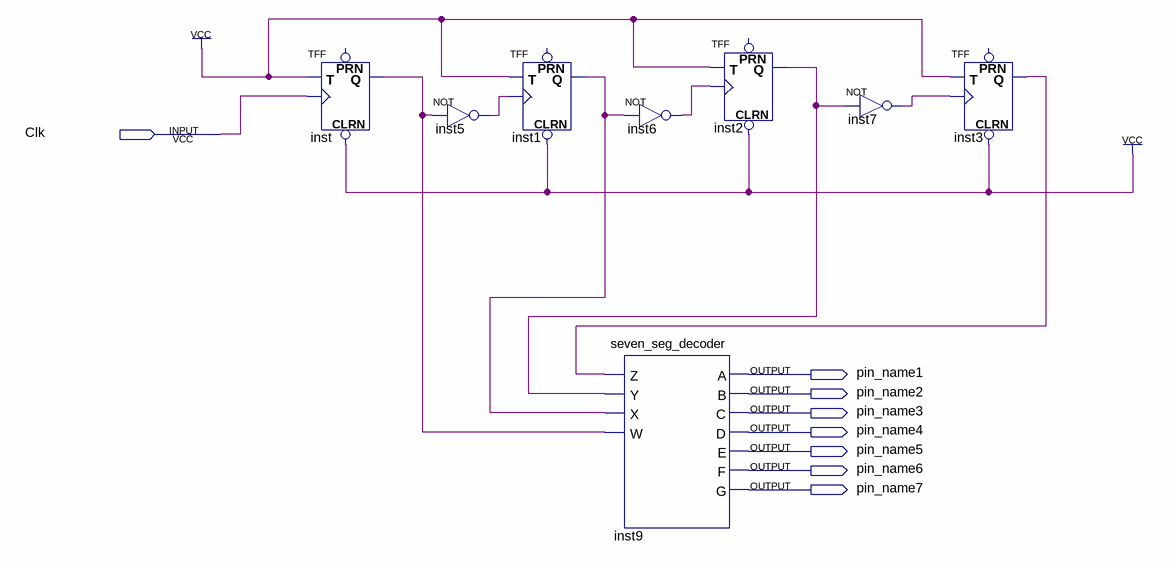
[diagram p0: schematic sheet]
// Quartus schematic lab10step3aa.bdf as structural Verilog: 8 symbols, 8 pins
module lab10step3aa (
  input  Clk,
  output pin_name1,
  output pin_name2,
  output pin_name3,
  output pin_name4,
  output pin_name5,
  output pin_name6,
  output pin_name7
);

  wire inst1_q, inst2_q, inst3_q, inst5_out, inst6_out, inst7_out, inst_q;

  TFF inst (.CLRN(1'b1), .T(1'b1), .CLK(Clk), .Q(inst_q));  // open: PRN
  not inst5 (inst5_out, inst_q);
  TFF inst1 (.CLRN(1'b1), .T(1'b1), .CLK(inst5_out), .Q(inst1_q));  // open: PRN
  not inst6 (inst6_out, inst1_q);
  seven_seg_decoder inst9 (
    .Z(inst3_q), .Y(inst2_q), .X(inst1_q), .W(inst_q), .A(pin_name1), .B(pin_name2), .C(pin_name3),
    .D(pin_name4), .E(pin_name5), .F(pin_name6), .G(pin_name7));
  TFF inst2 (.CLRN(1'b1), .T(1'b1), .CLK(inst6_out), .Q(inst2_q));  // open: PRN
  not inst7 (inst7_out, inst2_q);
  TFF inst3 (.CLRN(1'b1), .T(1'b1), .CLK(inst7_out), .Q(inst3_q));  // open: PRN
endmodule
